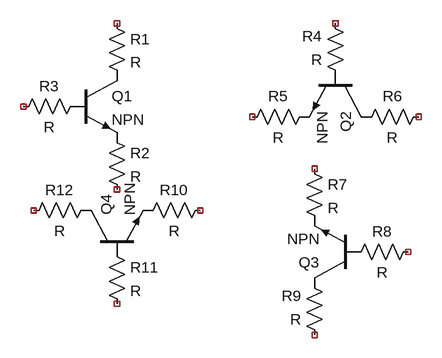
[diagram p0: schematic Draft11.asc]
Draft11.asc, the LTspice schematic file:
Version 4
SHEET 1 880 680
SYMBOL npn -32 64 R0
SYMATTR InstName Q1
SYMBOL npn 416 64 R90
SYMATTR InstName Q2
SYMBOL npn 400 384 R180
SYMATTR InstName Q3
SYMBOL npn -16 336 R270
SYMATTR InstName Q4
SYMBOL res 16 -32 R0
SYMATTR InstName R1
SYMBOL res 16 144 R0
SYMATTR InstName R2
SYMBOL res -16 96 R90
WINDOW 0 0 56 VBottom 2
WINDOW 3 32 56 VTop 2
SYMATTR InstName R3
SYMBOL res 384 80 R180
WINDOW 0 36 76 Left 2
WINDOW 3 36 40 Left 2
SYMATTR InstName R4
SYMBOL res 224 144 R270
WINDOW 0 32 56 VTop 2
WINDOW 3 0 56 VBottom 2
SYMATTR InstName R5
SYMBOL res 400 144 R270
WINDOW 0 32 56 VTop 2
WINDOW 3 0 56 VBottom 2
SYMATTR InstName R6
SYMBOL res 320 192 R0
SYMATTR InstName R7
SYMBOL res 496 320 R90
WINDOW 0 0 56 VBottom 2
WINDOW 3 32 56 VTop 2
SYMATTR InstName R8
SYMBOL res 352 480 R180
WINDOW 0 36 76 Left 2
WINDOW 3 36 40 Left 2
SYMATTR InstName R9
SYMBOL res 64 288 R270
WINDOW 0 32 56 VTop 2
WINDOW 3 0 56 VBottom 2
SYMATTR InstName R10
SYMBOL res 16 320 R0
SYMATTR InstName R11
SYMBOL res 0 256 R90
WINDOW 0 0 56 VBottom 2
WINDOW 3 32 56 VTop 2
SYMATTR InstName R12

The netlist it stands for:
* Draft11.asc
Q1 P001 P002 P003 0 NPN
Q2 P004 P005 P006 0 NPN
Q3 P007 P008 P009 0 NPN
Q4 P010 P011 P012 0 NPN
R1 NC_01 P001 R
R2 P003 NC_02 R
R3 P002 NC_03 R
R4 P005 NC_04 R
R5 NC_05 P006 R
R6 P004 NC_06 R
R7 NC_07 P009 R
R8 NC_08 P008 R
R9 NC_09 P007 R
R10 P012 NC_10 R
R11 P011 NC_11 R
R12 P010 NC_12 R
.model NPN NPN
.model PNP PNP
.lib standard.bjt
.backanno
.end